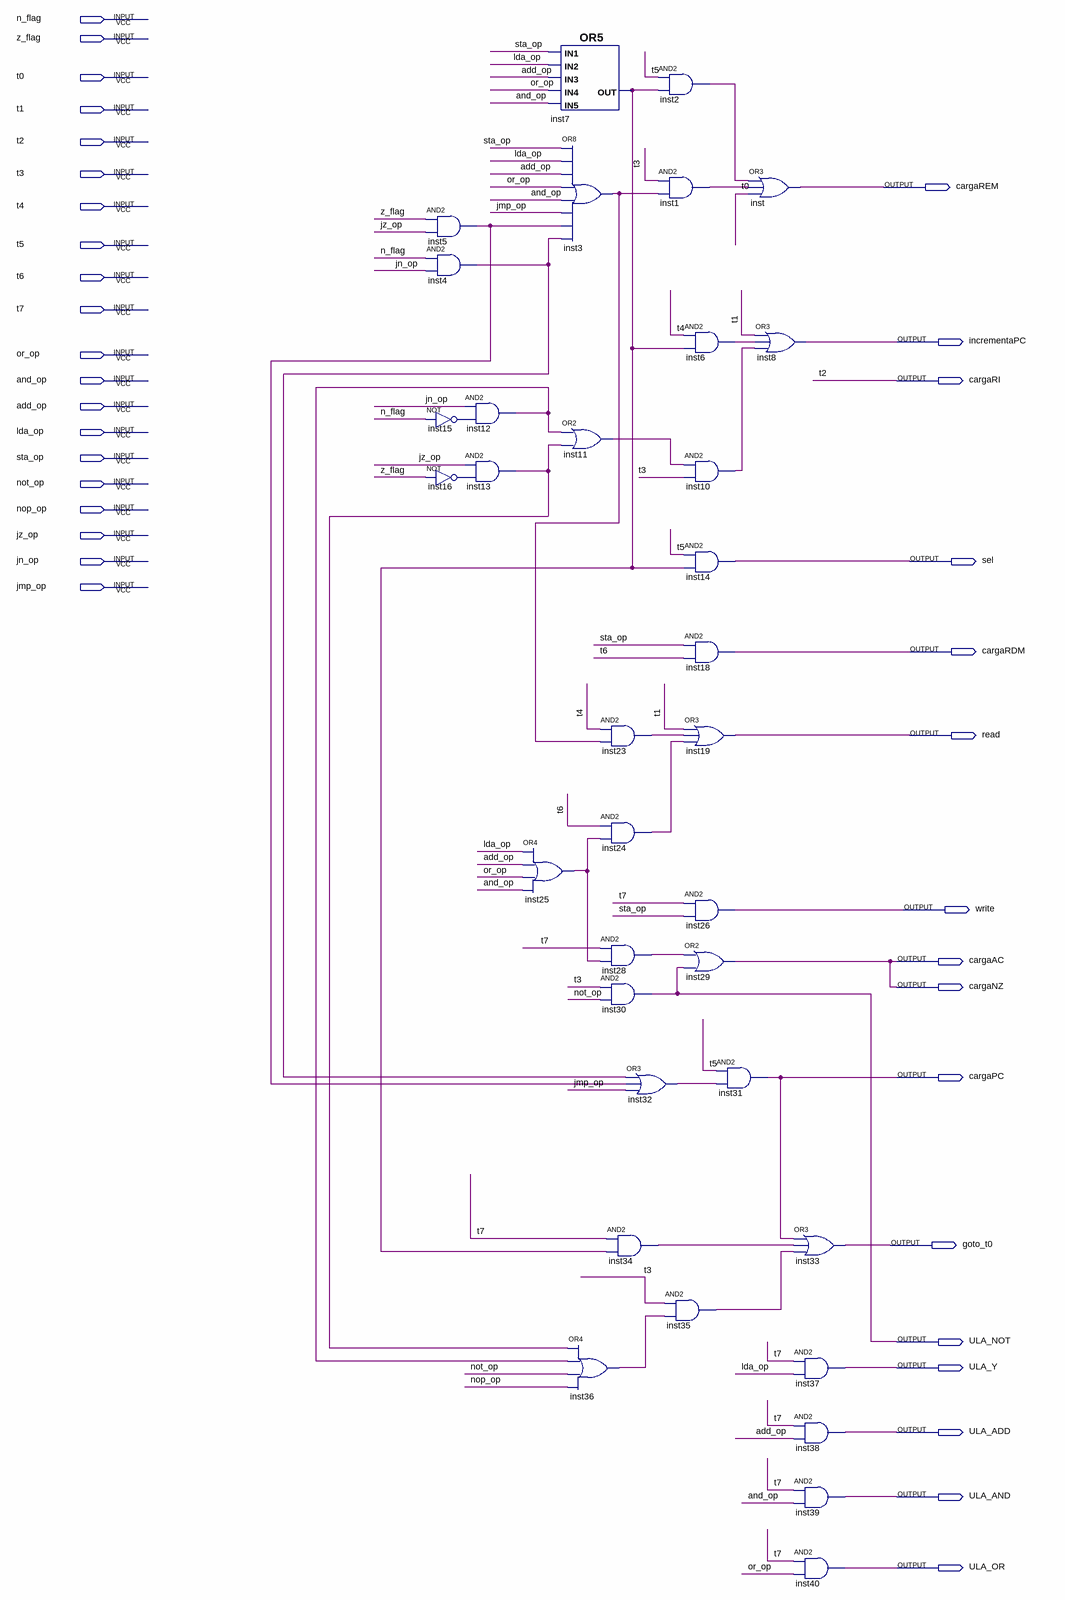
[diagram p0: schematic sheet]
// Quartus schematic UnidadeControle.bdf as structural Verilog: 35 symbols, 36 pins
module UnidadeControle (
  input  n_flag,
  input  z_flag,
  input  t0,
  input  t1,
  input  t2,
  input  t3,
  input  t4,
  input  t5,
  input  t6,
  input  t7,
  input  or_op,
  input  and_op,
  input  add_op,
  input  lda_op,
  input  sta_op,
  input  not_op,
  input  nop_op,
  input  jz_op,
  input  jn_op,
  input  jmp_op,
  output cargaREM,
  output incrementaPC,
  output cargaRI,
  output sel,
  output cargaRDM,
  output read,
  output write,
  output cargaAC,
  output cargaNZ,
  output cargaPC,
  output goto_t0,
  output ULA_NOT,
  output ULA_Y,
  output ULA_ADD,
  output ULA_AND,
  output ULA_OR
);

  wire inst1_out, inst2_out, inst3_out, inst4_out, inst5_out, inst6_out, inst7_out, inst10_out, inst11_out,
       inst12_out, inst13_out, inst15_out, inst16_out, inst23_out, inst24_out, inst25_out, inst28_out,
       inst32_out, inst34_out, inst35_out, inst36_out;

  and inst5 (inst5_out, z_flag, jz_op);
  and inst4 (inst4_out, n_flag, jn_op);
  not inst15 (inst15_out, n_flag);
  not inst16 (inst16_out, z_flag);
  and inst12 (inst12_out, jn_op, inst15_out);
  and inst13 (inst13_out, jz_op, inst16_out);
  or inst7 (inst7_out, sta_op, lda_op, add_op, or_op, and_op);
  or inst25 (inst25_out, lda_op, add_op, or_op, and_op);
  or inst3 (inst3_out, sta_op, lda_op, add_op, or_op, and_op, jmp_op, inst5_out, inst4_out);
  or inst11 (inst11_out, inst12_out, inst13_out);
  and inst23 (inst23_out, t4, inst3_out);
  and inst24 (inst24_out, t6, inst25_out);
  and inst28 (inst28_out, t7, inst25_out);
  and inst30 (ULA_NOT, t3, not_op);
  or inst36 (inst36_out, inst13_out, inst12_out, not_op, nop_op);
  or inst32 (inst32_out, inst4_out, inst5_out, jmp_op);
  and inst34 (inst34_out, t7, inst7_out);
  and inst2 (inst2_out, t5, inst7_out);
  and inst1 (inst1_out, t3, inst3_out);
  and inst6 (inst6_out, t4, inst7_out);
  and inst10 (inst10_out, inst11_out, t3);
  and inst14 (sel, t5, inst7_out);
  and inst18 (cargaRDM, sta_op, t6);
  or inst19 (read, t1, inst23_out, inst24_out);
  and inst26 (write, t7, sta_op);
  or inst29 (cargaAC, inst28_out, ULA_NOT);
  and inst35 (inst35_out, t3, inst36_out);
  or inst (cargaREM, inst2_out, inst1_out, t0);
  or inst8 (incrementaPC, t1, inst6_out, inst10_out);
  and inst31 (cargaPC, t5, inst32_out);
  or inst33 (goto_t0, cargaPC, inst34_out, inst35_out);
  and inst37 (ULA_Y, t7, lda_op);
  and inst38 (ULA_ADD, t7, add_op);
  and inst39 (ULA_AND, t7, and_op);
  and inst40 (ULA_OR, t7, or_op);

  assign cargaNZ = cargaAC;
  assign cargaRI = t2;
endmodule
